# EAGLE design TAH Remote Shield (EAGLE 7.0.0)
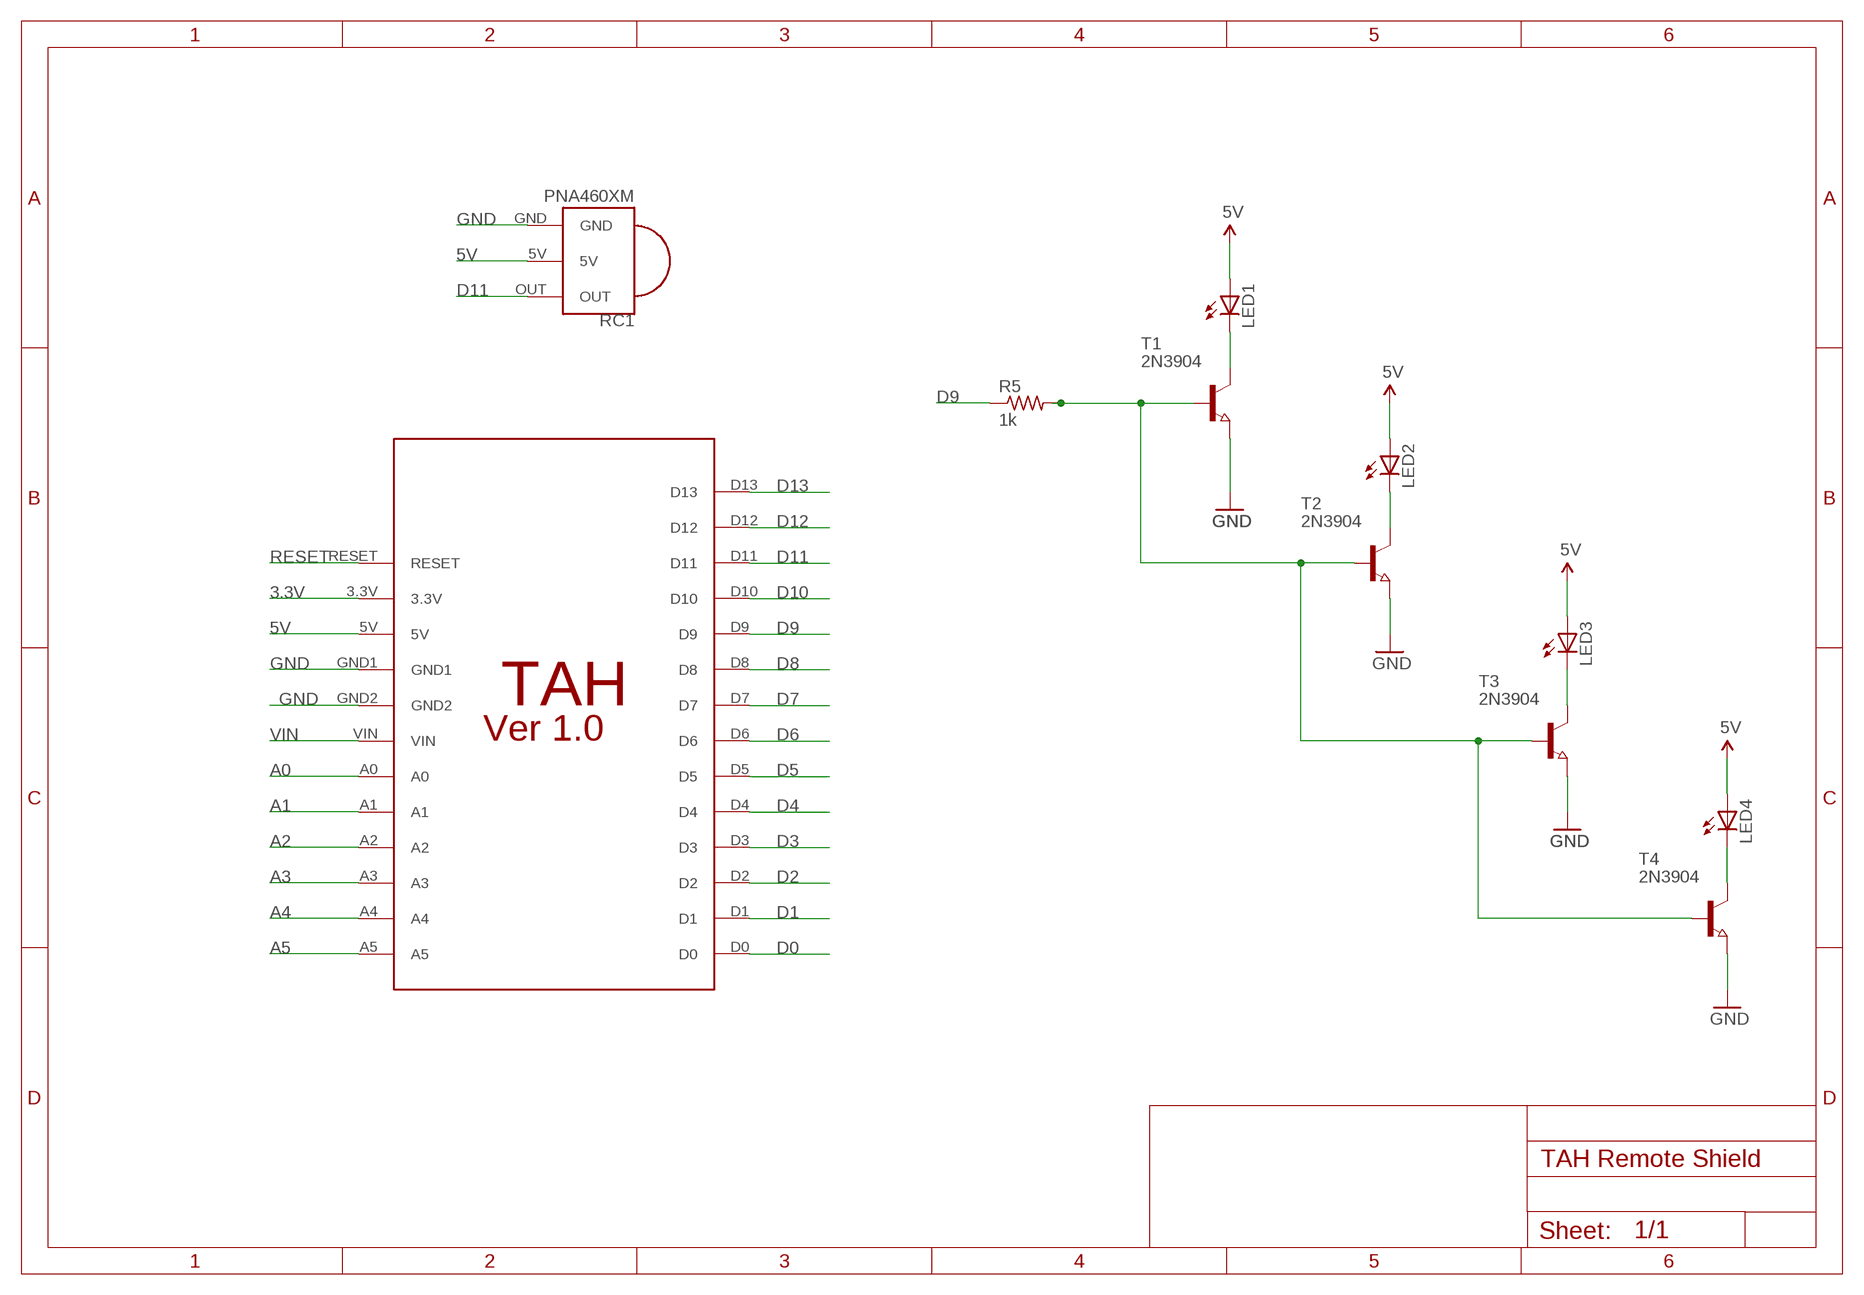
[diagram p0: schematic, sheet 1]

## Parts
LED1  LED5MM  [LED5MM]
LED2  LED5MM  [LED5MM]
LED3  LED5MM  [LED5MM]
LED4  LED5MM  [LED5MM]
R5  1k  R-US_M1206  [M1206]
RC1  PNA460XM  [PNA460XM]
T1  2N3904  NPN-TRANSISTOR_SOT23  [SOT23]
T2  2N3904  NPN-TRANSISTOR_SOT23  [SOT23]
T3  2N3904  NPN-TRANSISTOR_SOT23  [SOT23]
T4  2N3904  NPN-TRANSISTOR_SOT23  [SOT23]
U$2  TAH_PIN_FOOTPRINT_WITHOUT_ICSP_VER1.0  [TAH_PIN_FOOTPRINT_WITHOUT_ICSP_VER1.0]

## Nets
3.3V: U$2.3.3V
5V: LED1.A LED2.A LED3.A LED4.A RC1.5V U$2.5V
A0: U$2.A0
A1: U$2.A1
A2: U$2.A2
A3: U$2.A3
A4: U$2.A4
A5: U$2.A5
D0: U$2.D0
D1: U$2.D1
D2: U$2.D2
D3: U$2.D3
D4: U$2.D4
D5: U$2.D5
D6: U$2.D6
D7: U$2.D7
D8: U$2.D8
D9: R5.1 U$2.D9
D10: U$2.D10
D11: RC1.OUT U$2.D11
D12: U$2.D12
D13: U$2.D13
GND: RC1.GND T1.2(E) T2.2(E) T3.2(E) T4.2(E) U$2.GND1 U$2.GND2
N$1: LED1.K(C) T1.3(C)
N$2: LED2.K(C) T2.3(C)
N$3: LED4.K(C) T4.3(C)
N$4: LED3.K(C) T3.3(C)
N$5: R5.2 T1.1(B) T2.1(B) T3.1(B) T4.1(B)
RESET: U$2.RESET
VIN: U$2.VIN

## Library data of the parts
LED1-LED4 = 1n4148 diode sot 23:LED: LED OSRAM: - CHIPLED LG R971, LG N971, LY N971, LG Q971, LY Q971, LO R971, LY R971 LH N974, LH R974 LS Q976, LO Q976, LY Q976 LO Q996 - Hyper CHIPLED LW Q18S LB Q993, LB Q99A, LB R99A - SideLED LS A670, LO A670, LY A670, LG A670, LP A670 LB A673, LV A673, LT A673, LW A673 LH A674 LY A675 LS A676, LA A676, LO A676, LY A676, LW A676 LS A679, LY A679, LG A679 - Hyper Micro SIDELED® LS Y876, LA Y876, LO Y876, LY Y876 LT Y87S - SmartLED LW L88C, LW L88S LB L89C, LB L89S, LG L890 LS L89K, LO L89K, LY L89K LS L896, LA L896, LO L896, LY L896 - TOPLED LS T670, LO T670, LY T670, LG T670, LP T670 LSG T670, LSP T670, LSY T670, LOP T670, LYG T670 LG T671, LOG T671, LSG T671 LB T673, LV T673, LT T673, LW T673 LH T674 LS T676, LA T676, LO T676, LY T676, LB T676, LH T676, LSB T676, LW T676 LB T67C, LV T67C, LT T67C, LS T67K, LO T67K, LY T67K, LW E67C LS E67B, LA E67B, LO E67B, LY E67B, LB E67C, LV E67C, LT E67C LW T67C LS T679, LY T679, LG T679 LS T770, LO T770, LY T770, LG T770, LP T770 LB T773, LV T773, LT T773, LW T773 LH T774 LS E675, LA E675, LY E675, LS T675 LS T776, LA T776, LO T776, LY T776, LB T776 LHGB T686 LT T68C, LB T68C - Hyper Mini TOPLED® LB M676 - Mini TOPLED Santana® LG M470 LS M47K, LO M47K, LY M47K Source: http://www.osram.convergy.de/
R5 = 1n4148 diode sot 23:R-US_: RESISTOR, American symbol
RC1 = Infrared Receiver TSOP:PNA460XM: IR 38KHz receiver PNA4602 and related receivers http://www.ladyada.net/library/pcb/eaglelibrary.html
T1-T4 = semicon-smd-ipc:NPN-TRANSISTOR_: NPN TRANSISTOR
U$2 = TAH:TAH_PIN_FOOTPRINT_WITHOUT_ICSP_VER1.0

## Net classes
0 default: clearance 0.355 mm

## Board
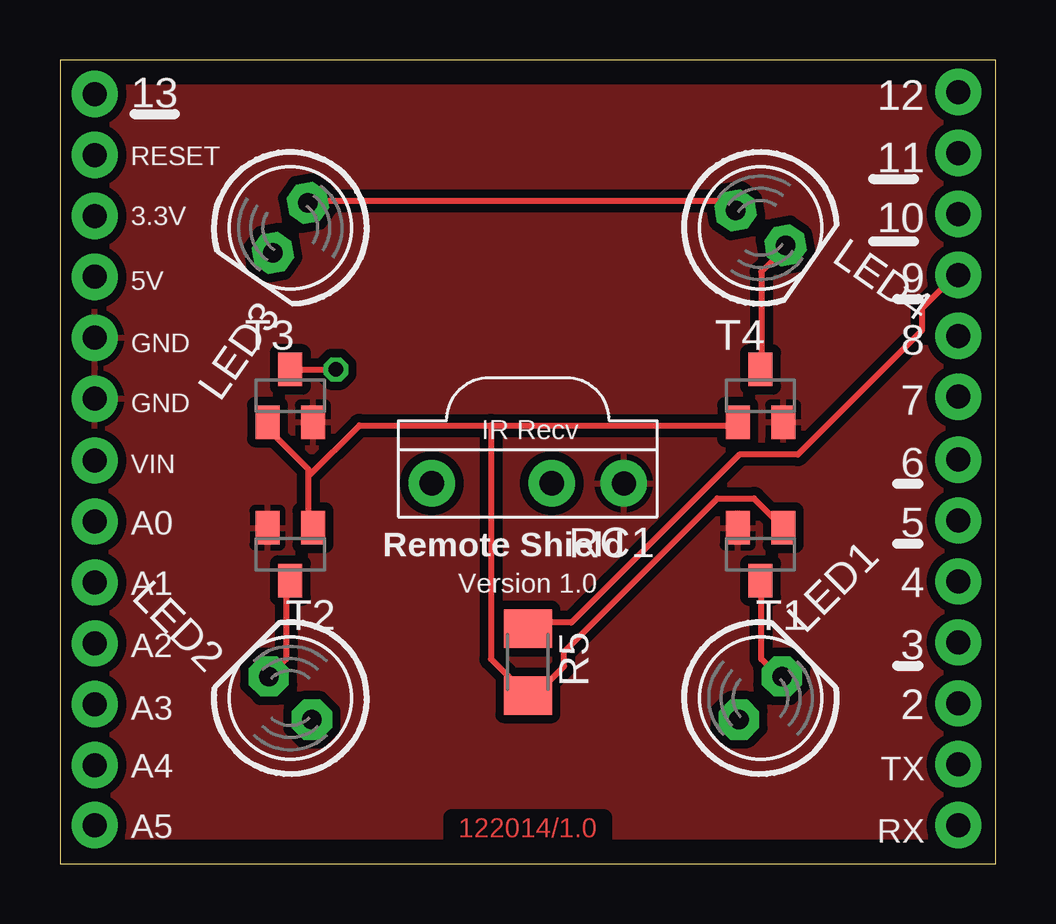
[diagram p1: board, top side]
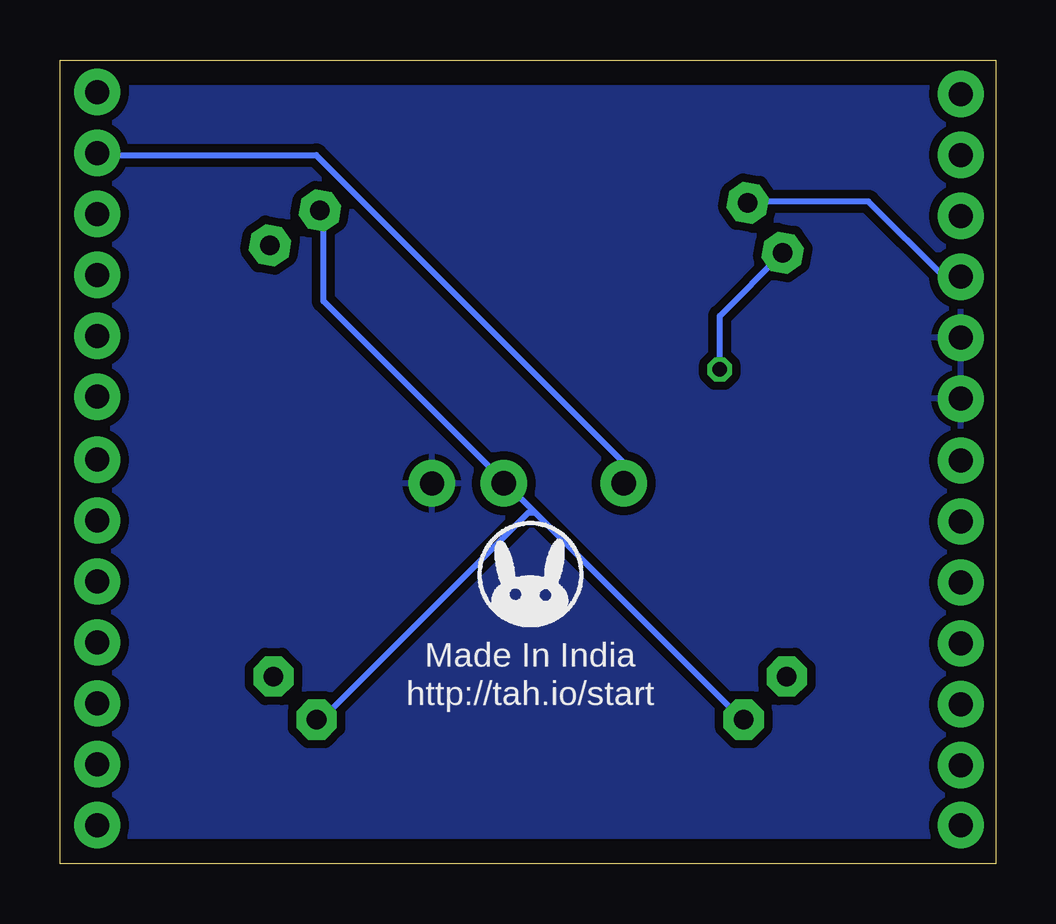
[diagram p2: board, bottom side, seen from below]

Size 39 x 33.5 mm. Coordinates in mm from the lower left corner, seen from the top.
Outline: 39,33.5 0,33.5 0,0 39,0 39,33.5
Copper layers (1*16): Top 0.035mm / dielectric 1.5mm / Bottom 0.035mm
Design rules "default": minimum track width 10mil, minimum drill 24mil, track to track 8mil, track to pad 8mil, pad to pad 8mil, via to via 8mil, smd to smd 8mil, copper to edge 40mil, drill to drill 8mil, minimum pad ring 10mil, minimum via ring 8mil, stop-mask expansion 4mil, vias tented up to drill 0mil, thermal gap 10mil

### Footprints (pad centres in the part's own frame; a part is rotated, then mirrored left to right if it is on the bottom)
LED5MM = drill 0.813 pad 1.676 octagon: A -1.27,0; K 1.27,0
M1206 = smd 1.6 x 2: 1 -1.4,0; 2 1.4,0
PNA460XM = drill 1.016 pad 1.93: 5V -1,0.9; OUT 4,0.9 | drill 1 pad 1.93: GND -4,0.9
SOT23 = smd 1 x 1.4: 1 -0.95,-1.1; 2 0.95,-1.1; 3 0,1.1
TAH_PIN_FOOTPRINT_WITHOUT_ICSP_VER1.0 = drill 1 pad 1.93: 3.3V -17.55,11.97; 5V -17.55,9.43; A0 -17.55,-0.77; A1 -17.55,-3.31; A2 -17.55,-5.85; A3 -17.55,-8.39; A4 -17.55,-10.93; A5 -17.55,-13.43; D0 18.45,-13.43; D1 18.45,-10.89; D2 18.45,-8.35; D3 18.45,-5.81; D4 18.45,-3.27; D5 18.45,-0.73; D6 18.45,1.81; D7 18.45,4.43; D8 18.45,6.97; D9 18.45,9.51; D10 18.45,12.05; D11 18.45,14.59; D12 18.45,17.13; D13 -17.55,17.05; GND1 -17.55,6.89; GND2 -17.55,4.35; RESET -17.55,14.51; VIN -17.55,1.77

### Placement (x,y rotation side)
LED1  29.2,6.9 45 top
LED2  9.6,6.9 135 top
LED3  9.6,26.5 235 top
LED4  29.2,26.5 325 top
R5  19.5,8.4 270 top
RC1  19.5,16.75 180 top
T1  29.2,12.9 180 top
T2  9.6,12.9 180 top
T3  9.6,19.5 0 top
T4  29.2,19.5 0 top
U$1  [TAHLOGO]  19.4,12.1 0 bottom
U$2  19,15.03 0 top
U$4  [TAH_PIN_FOOTPRINT_WITHOUT_ICSP_VERS1.0_SILK]  19.5,16.7 0 top

### Tracks (layer width: path | path; a pad name or v marks a point on that pad's centre or on a via)
5V
  Top 0.254: LED3.A 10.35,27.61 27.61,27.61 LED4.A
  Bottom 0.254: 19.18,14.62 20.4,15.83 RC1.5V 20.71,16.14 28.01,23.45 28.01,27.1 LED4.A | 19.18,14.62 10.66,6.09 LED2.A | 19.18,14.62 19.49,14.62 28.01,6.09 LED1.A | U$2.5V 2.16,24.46 5.3,27.6 10.27,27.6 LED3.A
D9
  Top 0.254: R5.1 19.79,10.05 21.32,10.05 28.32,17.05 30.75,17.05 35.93,22.23 35.93,23.14 37.15,24.36 U$2.D9
D11
  Bottom 0.254: RC1.OUT 15.53,16.14 15.53,16.75 28.32,29.54 37.15,29.54 U$2.D11
GND
  pour Bottom: 0,0 39,0 39,33.5 0,33.5
  pour Top: 0,0 39,0 39,33.5 0,33.5
N$1
  Top 0.254: T1.3 29.23,11.57 29.23,8.53 29.84,7.92 LED1.K
N$2
  Top 0.254: T2.3 9.44,11.57 9.44,8.53 8.83,7.92 LED2.K
N$3
  Top 0.254: T4.3 29.23,20.71 29.23,24.66 30.14,25.58 LED4.K
N$4  (via drill 0.6)
  Top 0.254: T3.3 v11.5,20.6
  Bottom 0.254: v11.5,20.6 11.5,22.83 LED3.K
N$5
  Top 0.254: T1.1 28.93,15.22 27.41,15.22 21.01,8.83 21.01,8.22 19.79,7 R5.2 19.49,7 17.96,8.53 17.96,18.27 | 10.35,16.14 10.35,16.44 8.53,18.27 T3.1 | 10.35,16.14 10.35,14.01 T2.1 | 17.96,18.27 12.48,18.27 10.35,16.14 | 17.96,18.27 28.01,18.27 T4.1

### Text on the board
Top: 122014/1.0
tPlace: Remote Shield | Version 1.0
bPlace: Made In India | http://tah.io/start
_tNames: IR Recv